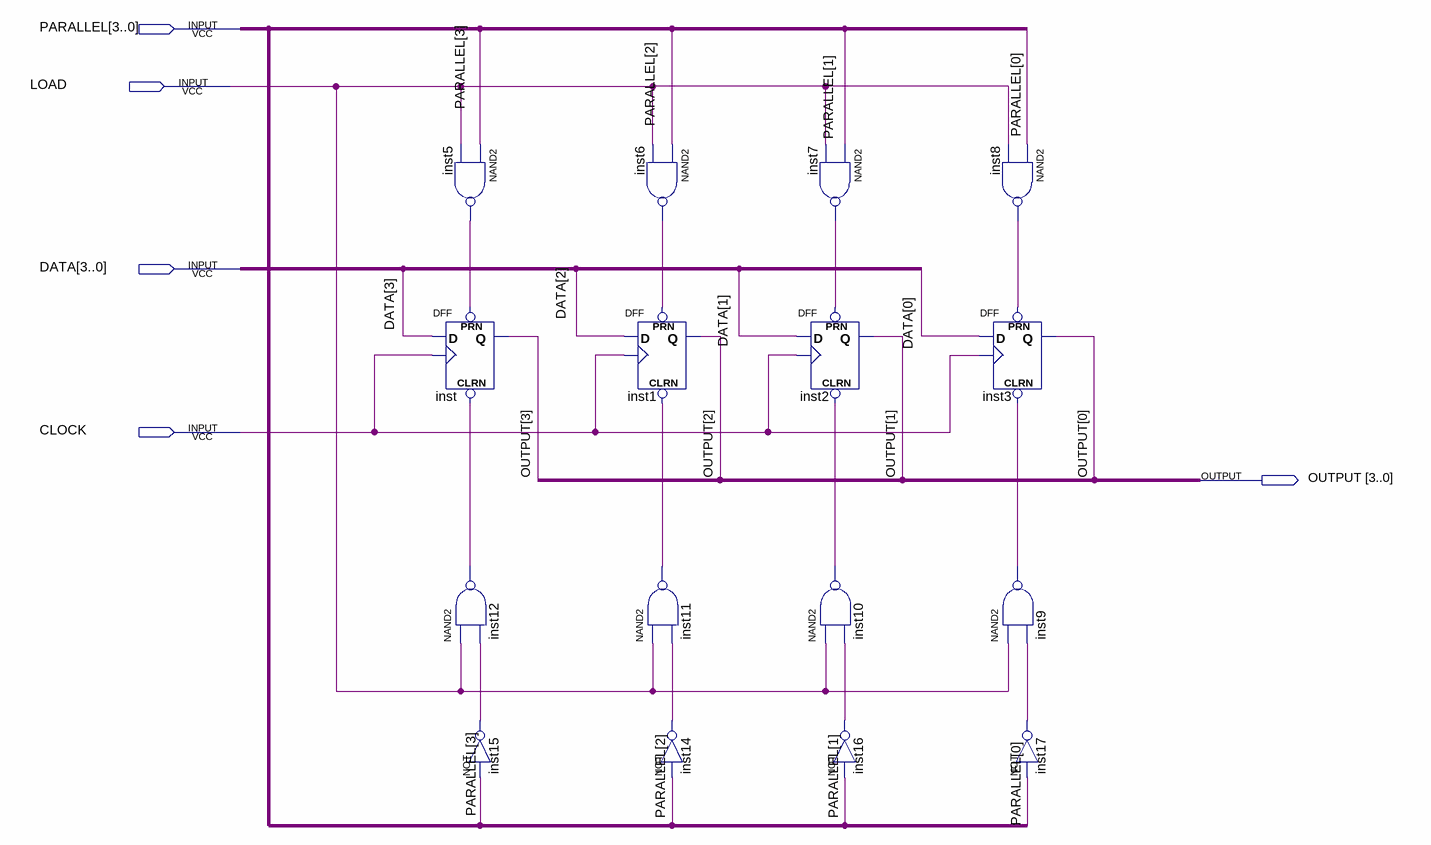
[diagram p0: schematic sheet]
// Quartus schematic register_4bit.bdf as structural Verilog: 16 symbols, 5 pins
module register_4bit (
  input  [3:0] PARALLEL,
  input  LOAD,
  input  [3:0] DATA,
  input  CLOCK,
  output [3:0] OUTPUT
);

  wire inst5_out, inst6_out, inst7_out, inst8_out, inst9_out, inst10_out, inst11_out, inst12_out, inst14_out,
       inst15_out, inst16_out, inst17_out;

  nand inst5 (inst5_out, PARALLEL[3], LOAD);
  DFF inst (.CLRN(inst12_out), .CLK(CLOCK), .D(DATA[3]), .PRN(inst5_out), .Q(OUTPUT[3]));
  nand inst12 (inst12_out, LOAD, inst15_out);
  not inst15 (inst15_out, PARALLEL[3]);
  DFF inst1 (.CLRN(inst11_out), .CLK(CLOCK), .D(DATA[2]), .PRN(inst6_out), .Q(OUTPUT[2]));
  nand inst6 (inst6_out, PARALLEL[2], LOAD);
  nand inst11 (inst11_out, LOAD, inst14_out);
  not inst14 (inst14_out, PARALLEL[2]);
  nand inst7 (inst7_out, PARALLEL[1], LOAD);
  DFF inst2 (.CLRN(inst10_out), .CLK(CLOCK), .D(DATA[1]), .PRN(inst7_out), .Q(OUTPUT[1]));
  nand inst10 (inst10_out, LOAD, inst16_out);
  not inst16 (inst16_out, PARALLEL[1]);
  nand inst8 (inst8_out, PARALLEL[0], LOAD);
  DFF inst3 (.CLRN(inst9_out), .CLK(CLOCK), .D(DATA[0]), .PRN(inst8_out), .Q(OUTPUT[0]));
  nand inst9 (inst9_out, LOAD, inst17_out);
  not inst17 (inst17_out, PARALLEL[0]);
endmodule
